# Altium project Sumobot_Schematics.PrjPcb
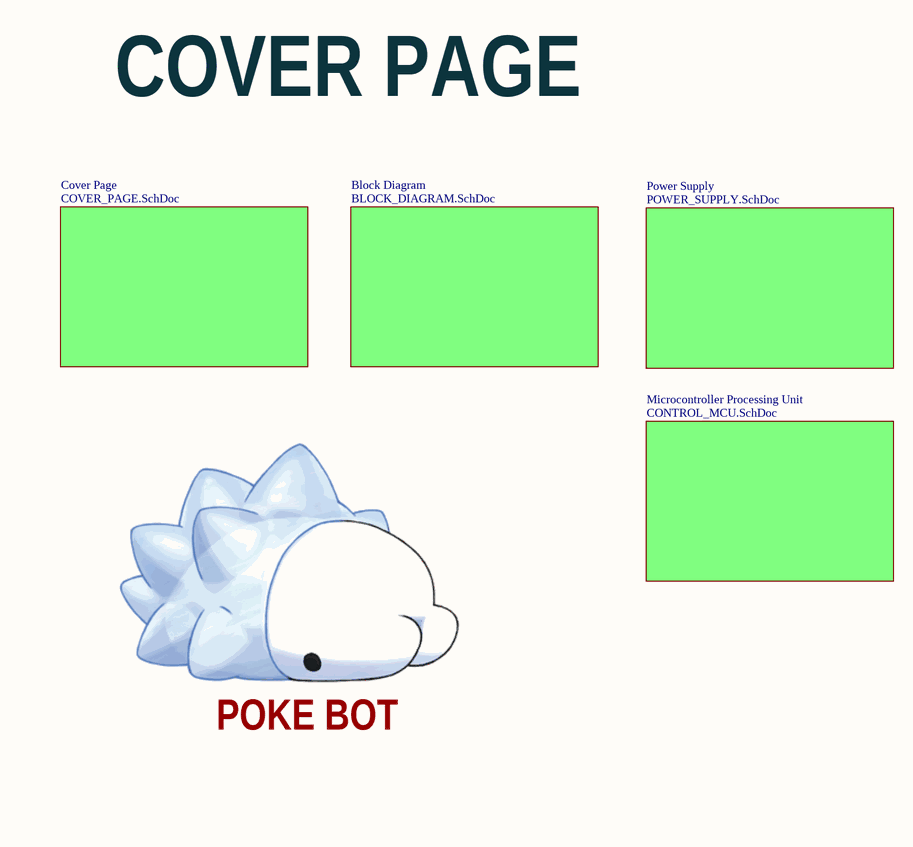
[diagram p0: DIRECTORY.SchDoc]
Author: Marcos R. López; Carnet: 231928; Curso: Fabricación de PCB [IE3028]; Revision: 1.0v
6 sheets, 27 parts. Net scope: flat (ports and power ports of the same name join across sheets).
Sheets:
  DIRECTORY.SchDoc
    Cover Page = COVER_PAGE.SchDoc
    Block Diagram = BLOCK_DIAGRAM.SchDoc
    Power Supply = POWER_SUPPLY.SchDoc
    Microcontroller Processing Unit = CONTROL_MCU.SchDoc
  PCB_ManufactureDiagram.SchDoc

## Sheet DIRECTORY.SchDoc
size A4; SheetNumber: 1; SheetTotal: 6

### Sub-sheets
Block Diagram = BLOCK_DIAGRAM.SchDoc: no entries
Cover Page = COVER_PAGE.SchDoc: no entries
Microcontroller Processing Unit = CONTROL_MCU.SchDoc: no entries
Power Supply = POWER_SUPPLY.SchDoc: no entries

### Notes on the sheet
- COVER PAGE
- POKE BOT
- Documento:
- Autor:
- Carnet:
- Proyecto:
- Curso:
- Fecha:
- Revisión:
- Tamaño:
- Carta
- Hoja:
- de:

## Sheet COVER_PAGE.SchDoc
size A4; SheetNumber: 2; SheetTotal: 6
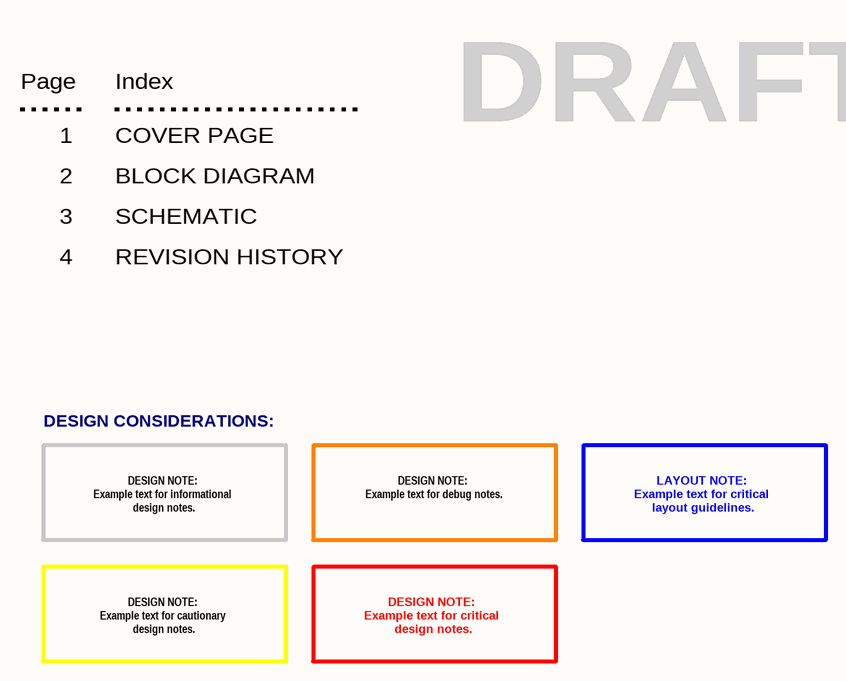
[diagram p1: COVER_PAGE.SchDoc]

### Notes on the sheet
- Page
- 1
- Index
- COVER PAGE
- DRAFT
- 2
- BLOCK DIAGRAM
- 3
- 4
- SCHEMATIC
- REVISION HISTORY
- DESIGN CONSIDERATIONS:
- DESIGN NOTE:
  Example text for debug notes.
- DESIGN NOTE:
  Example text for informational
  design notes.
- LAYOUT NOTE:
  Example text for critical
  layout guidelines.
- DESIGN NOTE:
  Example text for cautionary
  design notes.
- DESIGN NOTE:
  Example text for critical
  design notes.
- Documento:
- Autor:
- Carnet:
- Proyecto:
- Curso:
- Fecha:
- Revisión:
- Tamaño:
- Carta
- Hoja:
- de:

## Sheet BLOCK_DIAGRAM.SchDoc
size A4; SheetNumber: 2; SheetTotal: 6
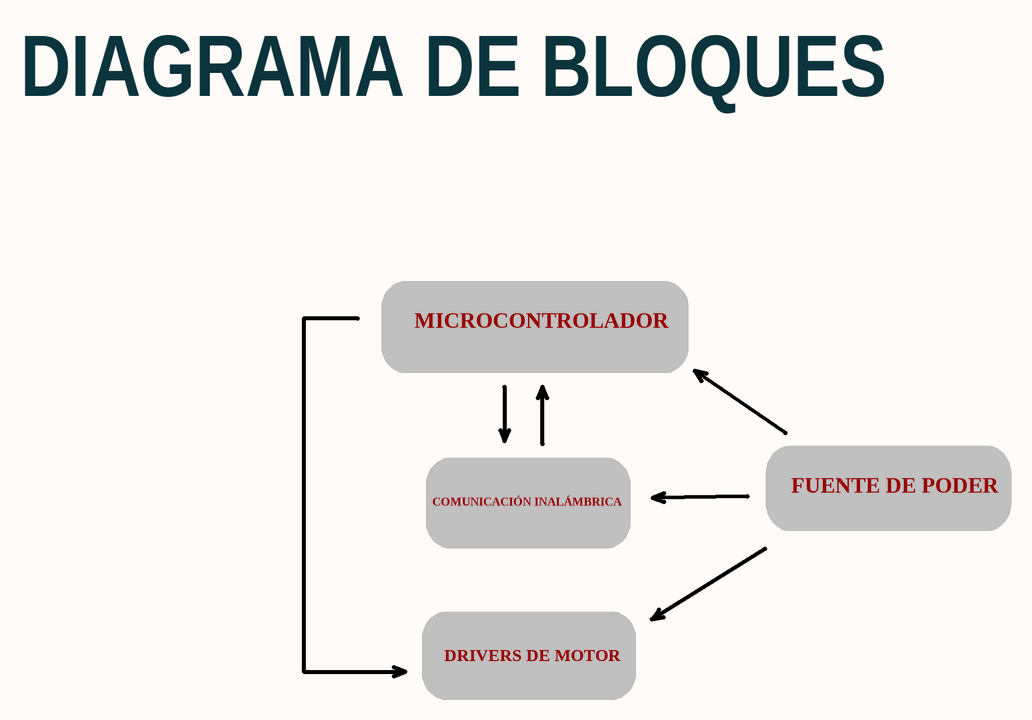
[diagram p2: BLOCK_DIAGRAM.SchDoc]

### Notes on the sheet
- DIAGRAMA DE BLOQUES
- MICROCONTROLADOR
- COMUNICACIÓN INALÁMBRICA
- FUENTE DE PODER
- DRIVERS DE MOTOR
- Documento:
- Autor:
- Carnet:
- Proyecto:
- Curso:
- Fecha:
- Revisión:
- Tamaño:
- Carta
- Hoja:
- de:

## Sheet POWER_SUPPLY.SchDoc
size A4; SheetNumber: 4; SheetTotal: 5
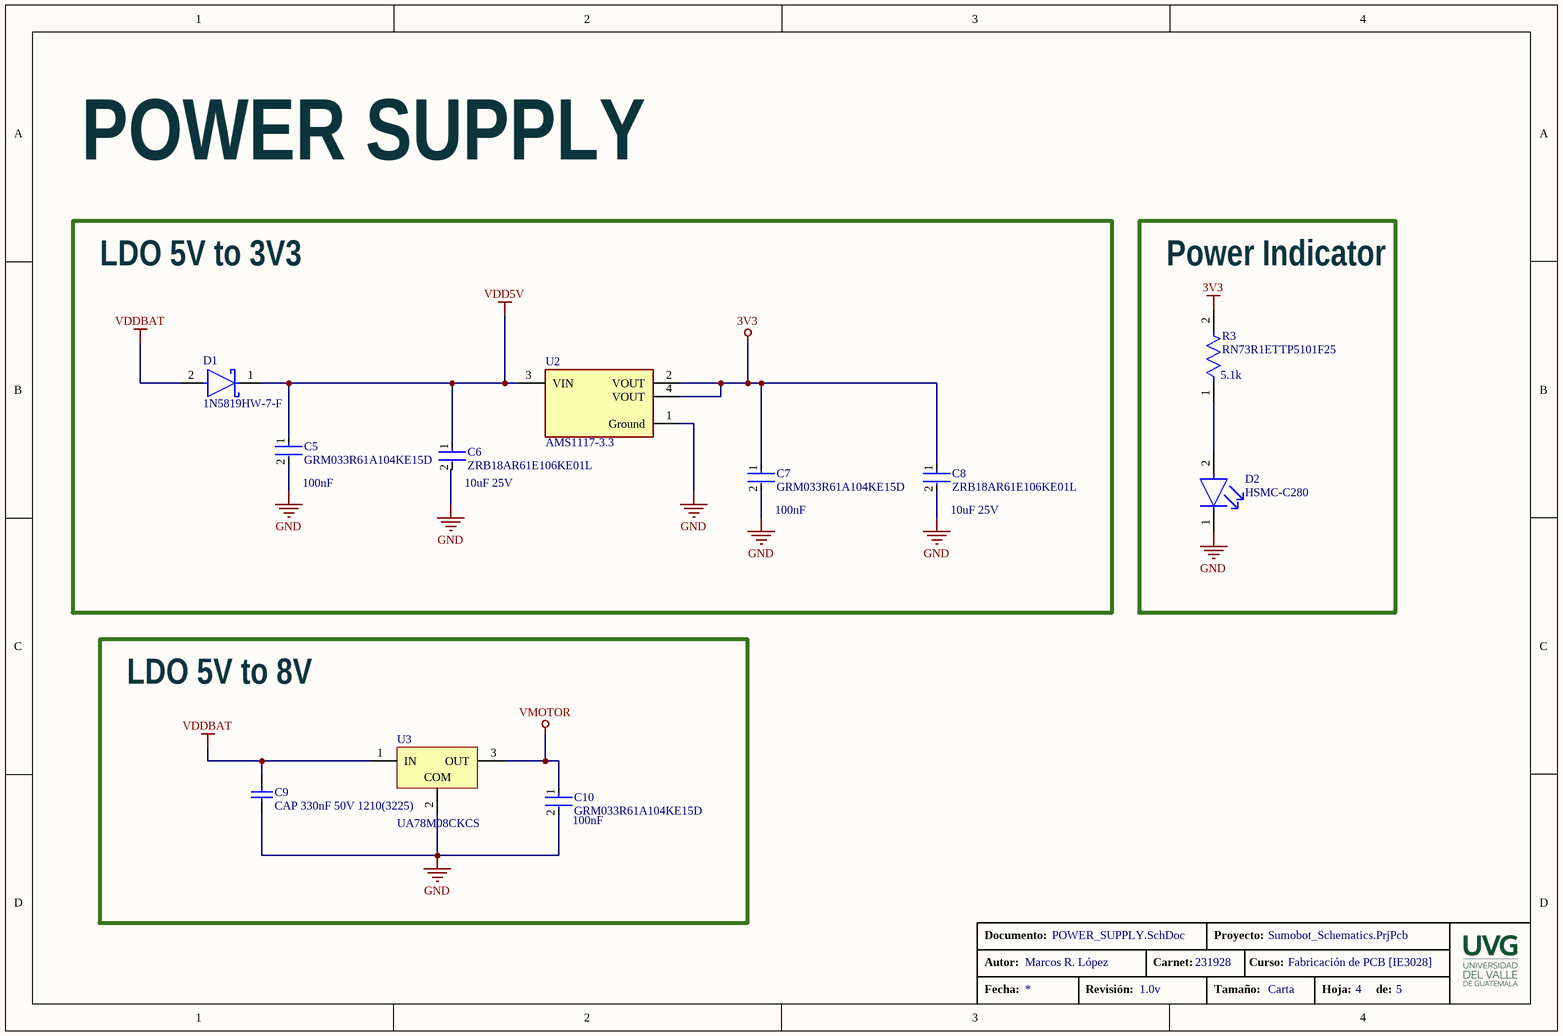
[diagram p3: POWER_SUPPLY.SchDoc]

### Parts
C5  GRM033R61A104KE15D  Capacitance: 100nF  [FP-GRM033-0_03-IPC_C]
C6  ZRB18AR61E106KE01L  value 10uF 25V  [FP-ZRB18A-0_2-MFG]
C7  GRM033R61A104KE15D  Capacitance: 100nF  [FP-GRM033-0_03-IPC_C]
C8  ZRB18AR61E106KE01L  value 10uF 25V  [FP-ZRB18A-0_2-MFG]
C9  CAP 330nF 50V 1210(3225)  [CAPC1210(3225)105_L]
C10  GRM033R61A104KE15D  Capacitance: 100nF  [FP-GRM033-0_03-IPC_C]
D1  1N5819HW-7-F  [FP-SOD123-IPC_A]
D2  HSMC-C280  [FP-HSMC-C280-MFG]
R3  RN73R1ETTP5101F25  value 5.1k  [FP-RN73R1E-IPC_C]
U2  AMS1117-3.3  [FP-AMS1117-IPC_C]
U3  UA78M08CKCS  [KCS0003A]

### Blocks framed on the sheet
LDO 5V to 3V3: C5-C8 D1 U2
Power Indicator: D2 R3
LDO 5V to 8V: C9 C10 U3

### Nets
3V3: C7.1 C8.1 R3.2 U2.2(VOUT) U2.4(VOUT)  [project net TX]
GND: C5.2 C6.2 C7.2 C8.2 C9.1 C10.2 D2.1(C) U2.1(Ground) U3.2(COM)
VDD5V: C5.1 C6.1 D1.1(C) U2.3(VIN)
VDDBAT: C9.2 D1.2(A) U3.1(IN)
VMOTOR: C10.1 U3.3(OUT)
NetD2_2: D2.2(A) R3.1

### Notes on the sheet
- POWER SUPPLY
- Documento:
- Autor:
- Carnet:
- Proyecto:
- Curso:
- Fecha:
- Revisión:
- Tamaño:
- Carta
- Hoja:
- de:

### Library data of the parts
C5 C7 C10 = CMP-2010-01264-2: Chip Multilayer Ceramic Capacitors for General Purpose, 0201, 0.10uF, X5R, 15%, 10%, 10V; Mount: Surface Mount; Dielectric: X5R; Width: 0.012inch; Tolerance: 10%; Radiation Hardening: No; Voltage Rating: 10V; REACH SVHC: No SVHC; Height: 0.3mm; Max Operating Temperature: 85°C; Voltage Rating (DC): 10V; Thickness: 0.013inch; Termination: SMD/SMT; Lead Free: Lead Free; Package Quantity: 1; Case/Package: 0201; Min Operating Temperature: -55°C; Weight: 6E-06oz; Length: 0.6mm; Case Code (Imperial): 0201; Depth: 0.3mm; Voltage: 10V; Packaging: Tape and Reel; Case Code (Metric): 0603
C6 C8 = CMP-06035-063177-1: Low Acoustic Noise Chip Multilayer Ceramic Capacitors on Interposer Board for General Purpose ZRB Series 0603 Package 1.2mm X5R @ 15% 25Vdc 10uF @ 10%
C9 = CMP-1038-01880-1: CAP 330nF 50V ±10% 1210 (3225 Metric) Thickness 1.05mm SMD; Tolerance: Â±10%; Case-Metric: 3225; Case-EIA: 1210; Technology: SMT; Rated Voltage: 50 V; Value: 330nF; Max Thickness: 1.05 mm
D1 = CMP-0303-00003-3: DIODE SCHOTTKY 40V 1A SOD123; Forward Voltage: 450mV; Capacitance: 110pF; Max Forward Surge Current (Ifsm): 25A; Peak Reverse Current: 50uA; Polarity: Standard; Element Configuration: Single; Max Power Dissipation: 450mW; Min Operating Temperature: -65°C; Package Quantity: 3000; Contact Plating: Tin; Weight: 0.000353oz; Max Repetitive Reverse Voltage (Vrrm): 40V; Max Reverse Voltage (DC): 40V; Height: 1.25mm; Average Rectified Current: 1A; Width: 1.7mm; Case/Package: SOD-123-2; Lead Free: Lead Free; Max Operating Temperature: 125°C; Current Rating: 1A; Termination: SMD/SMT; Forward Current: 1A; Radiation Hardening: No; Number of Pins: 2; Length: 2.85mm; Voltage Rating (DC): 40V; REACH SVHC: No SVHC; Peak Non-Repetitive Surge Current: 25A; Packaging: Tape and Reel; Output Current: 1A
D2 = CMP-18399-000022-1: LED RED DIFFUSED 0402 SMD; Dominant Wavelength: 626nm; Number of Elements: 1; Luminous Intensity: 90mcd; Viewing Angle: 130°; Reverse Voltage: 5V; Forward Current: 20mA; Lens Color: White; Power Rating: 60mW; Forward Voltage: 1.9V; Luminous Flux: 155lm; Contact Plating: Gold; Number of Pins: 2; REACH SVHC: No SVHC; Lens Style: Diffused; Color: Red; Packaging: Tape and Reel; Max Operating Temperature: 85°C; Radiation Hardening: No; Length: 1mm; Number of LEDs: 1; Case/Package: 0402; Min Operating Temperature: -40°C; Case Code (Metric): 1005; Case Code (Imperial): 0402; Test Current: 20mA; Lead Free: Lead Free; Height: 0.4mm; Illumination Color: Red; Max Power Dissipation: 60mW; Package Quantity: 4000; Mount: Surface Mount; Wavelength: 626nm; Depth: 0.5mm; Lens Transparency: Diffused; Power Dissipation: 60mW; Width: 0.5mm
R3 = CMP-04015-008529-1: 5.1kΩ ±1% 0.063W, 1/16W Chip Resistor 0402 (1005 Metric) Moisture Resistant Thin Film
U2 = CMP-209535-000001-1: LDO Voltage Regulators 1A, 3.3V; Manufacturer: Advanced Monolithic Systems; Dropout Voltage: 1.1V; Output Type: Fixed; Nominal Supply Current: 5mA; Max Power Dissipation: 1.2W; Max Supply Voltage: 15V; Number Of Outputs: 1; Standoff Height: 0.64mm; Max Junction Temp: +125°C; Height: 1.8mm; Package: AMS1117; Device Class L2: Power Management ICs; ComponentLink2Description: Datasheet; ComponentLink2URL: http://www.advanced-monolithic.com/pdf/ds1117.pdf; Category: IC; RoHS: TRUE; Automotive: No; Device Class L1: Integrated Circuits (ICs); Output Current: 1A; Device Class L3: Voltage Regulators - Linear; Temperature: -40°C to +125°C; Output Voltage: 3.3V; Manufacturer Part Number: AMS1117-3.3; Temperature Range Low: -40°C; Octopart: https://octopart.com/ams1117-3.3-advanced+monolithic+systems-25899300; Lead Free: Yes; Ipc Land Pattern Name: SOT229P700X180-4; Temperature Range High: +125°C
U3 = CMP-0324-00074-2: Fixed Regulator with 10.5 to 25 V Input and 8 V Output, 0 to 125 degC, 3-Pin TO-220 (KCS), Pb-Free (RoHS); Manufacturer: Texas Instruments; Vin(Max)(V): 25; Vout(Min)(V): 8; Iout(Max)(A): 0.5; Vin(Min)(V): 10.5; Iq(Typ)(mA): 6; SubFamily: Standard Voltage Regulator; PackageReference: KCS0003A; ComponentLink2Description: URL Link1; ComponentLink1Description: Datasheet; Eco-Plan: Pb-Free (RoHS); PackageDescription: Plastic Cylindrical Package, Formed Lead Option (TO-92); PackageVersion: revC, Oct-2001; Mounting Technology: Through Hole; Code_JEDEC: TO-226-AA; DatasheetVersion: SLVS059Q; ComponentLink2URL: Samples URL:http://www.ti.com/product/ua78m08#samples; Vout(Max)(V): 8; PartNumber: UA78M08CKCS; ComponentLink1URL: http://www.ti.com/general/docs/lit/getliterature.tsp?genericPartNumber=UA78M08&fileType=pdf

## Sheet CONTROL_MCU.SchDoc
size A4; SheetNumber: 4; SheetTotal: 5
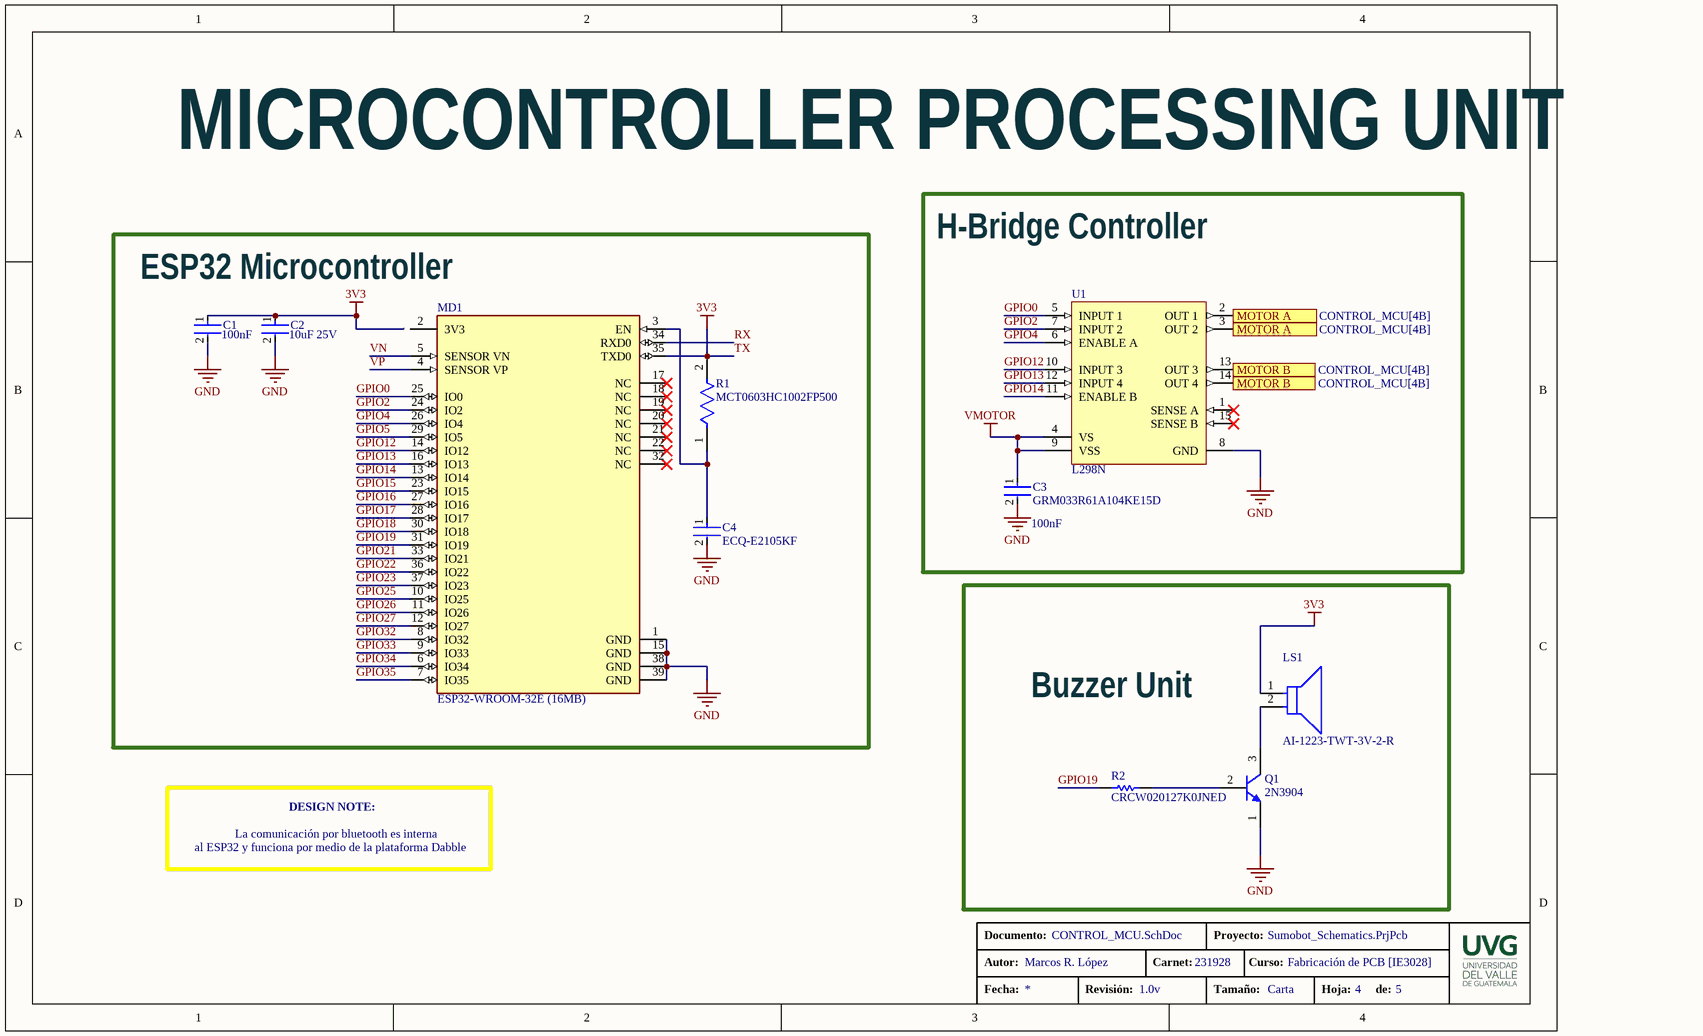
[diagram p4: CONTROL_MCU.SchDoc]

### Parts
C1  Capacitance: 100nF  [FP-GRM033-0_03-IPC_C]  (hidden comment: M033R61A104KE15D)
C2  value 10uF 25V  [FP-ZRB18A-0_2-MFG]  (hidden comment: ZRB18AR61E106KE01L)
C3  GRM033R61A104KE15D  Capacitance: 100nF  [FP-GRM033-0_03-IPC_C]
C4  ECQ-E2105KF  [FP-ECQ-E2105KF-MFG]
LS1  AI-1223-TWT-3V-2-R  [FP-AI-1223-TWT-3V-2-R-MFG]
MD1  ESP32-WROOM-32E (16MB)  [FP-ESP32-WROOM-32E_16MB-MFG]
Q1  2N3904  [ONSC-TO-92-3-29-11]
R1  MCT0603HC1002FP500  [FP-MCT0603-IPC_B]
R2  CRCW020127K0JNED  [RESC0603X28X15ML05T05]
U1  L298N  [STM-FM-15]

### Blocks framed on the sheet
H-Bridge Controller: C3 U1
ESP32 Microcontroller: C1 C2 C4 MD1 R1
Buzzer Unit: LS1 Q1 R2

### Ports
MOTOR A (see CONTROL_MCU[4B]), MOTOR B (see CONTROL_MCU[4B])

### Nets
GND: C1.2 C2.2 C3.2 C4.2 MD1.1(GND) MD1.15(GND) MD1.38(GND) MD1.39(GND) Q1.1(E) U1.8(GND)
TX: C1.1 C2.1 LS1.1(C) MD1.35(TXD0) R1.2  [also labelled 3V3]
VMOTOR: C3.1 U1.4(VS) U1.9(VSS)
GPIO0: MD1.25(IO0) U1.5(INPUT_1)
GPIO2: MD1.24(IO2) U1.7(INPUT_2)
GPIO4: MD1.26(IO4) U1.6(ENABLE_A)
GPIO5: MD1.29(IO5)
GPIO12: MD1.14(IO12) U1.10(INPUT_3)
GPIO13: MD1.16(IO13) U1.12(INPUT_4)
GPIO14: MD1.13(IO14) U1.11(ENABLE_B)
GPIO15: MD1.23(IO15)
GPIO16: MD1.27(IO16)
GPIO17: MD1.28(IO17)
GPIO18: MD1.30(IO18)
GPIO19: MD1.31(IO19) R2.2
GPIO21: MD1.33(IO21)
GPIO22: MD1.36(IO22)
GPIO23: MD1.37(IO23)
GPIO25: MD1.10(IO25)
GPIO26: MD1.11(IO26)
GPIO27: MD1.12(IO27)
GPIO32: MD1.8(IO32)
GPIO33: MD1.9(IO33)
GPIO34: MD1.6(IO34)
GPIO35: MD1.7(IO35)
RX: MD1.34(RXD0)
VN: MD1.5(SENSOR_VN)
VP: MD1.4(SENSOR_VP)
NetC4_1: C4.1 MD1.3(EN) R1.1
NetLS1_2: LS1.2(A) Q1.3(C)
NetQ1_2: Q1.2(B) R2.1
NetU1_2: U1.2(OUT_1) U1.3(OUT_2) ; port MOTOR A
NetU1_13: U1.13(OUT_3) U1.14(OUT_4) ; port MOTOR B

Not connected (* = marked no-connect by the designer): MD1 2(3V3) 17(NC)* 18(NC)* 19(NC)* 20(NC)* 21(NC)* 22(NC)* 32(NC)*; U1 1(SENSE_A)* 15(SENSE_B)*

### Notes on the sheet
- MICROCONTROLLER PROCESSING UNIT
- al ESP32 y funciona por medio de la plataforma Dabble
- La comunicación por bluetooth es interna
- DESIGN NOTE:
- Documento:
- Autor:
- Carnet:
- Proyecto:
- Curso:
- Fecha:
- Revisión:
- Tamaño:
- Carta
- Hoja:
- de:

### Library data of the parts
C1 C3 = CMP-2010-01264-2: as C5 on sheet POWER_SUPPLY; Mount: Surface Mount; Dielectric: X5R; Width: 0.012inch; Tolerance: 10%; Radiation Hardening: No; Voltage Rating: 10V; REACH SVHC: No SVHC; Height: 0.3mm; Max Operating Temperature: 85°C; Voltage Rating (DC): 10V; Thickness: 0.013inch; Termination: SMD/SMT; Lead Free: Lead Free; Package Quantity: 1; Case/Package: 0201; Min Operating Temperature: -55°C; Weight: 6E-06oz; Length: 0.6mm; Case Code (Imperial): 0201; Depth: 0.3mm; Voltage: 10V; Packaging: Tape and Reel; Case Code (Metric): 0603
C2 = CMP-06035-063177-1: as C6 on sheet POWER_SUPPLY
C4 = CMP-00287-00215881-1: ECQ-E2105KF Cap Film 1uF 250V PET 10% (18.5 X 7.4 X 15mm) Radial 15mm 105 C Bulk; NexarPartId: 215881; Lead Length: 20mm; Lead Diameter: 800µm; Lead/Base Style: Straight; Capacitance: 1µF; Dielectric Material: Polyester; Voltage Rating (AC): 250V; Tolerance: 10%; REACH SVHC: Unknown; Contact Plating: Tin; Height - Seated (Max): 16.002mm; Length: 18.5mm; Lead Free: Lead Free; Voltage Rating: 250V; Dielectric: PET; Height: 15mm; Radiation Hardening: No; Mount: Through Hole; Packaging: Bulk; Min Operating Temperature: -40°C; Width: 7.3914mm; Depth: 7.4mm; Case/Package: Radial; Voltage Rating (DC): 250V; Schedule B: 8532250070, 8532250070; RoHS: Compliant; Termination: Radial; Lead Pitch: 15mm; Max Operating Temperature: 105°C
LS1 = CMP-103888-000003-1: BUZZER MAGNETIC 3V 12MM TH; Min Supply Voltage (DC): 2V; Operating Supply Current: 30mA; Max Supply Voltage (DC): 4V; Input Type: DC; Frequency: 2.3kHz; Series: AI; Nominal Supply Voltage (DC): 3V; Packaging: Tray; Max Operating Temperature: 70°C; Height: 7.5mm; Termination: PC Pins; Max Supply Current: 30mA; Mount: Through Hole; Diameter: 12mm; Voltage Rating: 3V; Sensing Method: Magnetic; Min Operating Temperature: -20°C; Contact Plating: Tin
MD1 = CMP-194065-000027-1: RX TXRX MOD WIFI TRACE ANT SMD
Q1 = CMP-2000-05562-1: General Purpose Transistor, NPN Silicon, 200 mA, 60 V, -55 to 150 degC, 3-Pin TO-92, RoHS, Bulk; Manufacturer: ONSemiconductor; Emitter- Base Voltage VEBO: 6V; Maximum Power Dissipation: 625mW; Maximum DC Collector Current: 0.2A; Collector- Emitter Voltage VCEO Max: 40V; Collector- Base Voltage VCBO: 60V; DC Collector/Base Gain hfe Min: 60; Configuration: Single; Collector-Emitter Saturation Voltage: 0.3V; Gain Bandwidth Product fT: 270MHz; Mounting Style: ThroughHole; Package / Case: TO-92-3(TO-226); Mounting Technology: ThroughHole; Minimum Operating Temperature: -65C; Datasheet Version: Rev. 8, 08/2012; Product Category: BipolarTransistors-BJT; Factory Pack Quantity: 5000; Transistor Polarity: NPN; Package Description: 3-Pin Transistor Outline, Body 4.825 x 3.685 mm, Pitch 1.27 mm; RoHS: Details; Datasheet URL: https://datasheet.ciiva.com/4725/2n3903-d-285841-4725808.pdf; Packaging: Bulk; Maximum Operating Temperature: +150C; Package Reference: TO-92-3-29-11; Brand: ONSemiconductor; Manufacturer URL: http://www.onsemi.com/
R1 = CMP-02407-001090-1: RES SMD 100 OHM 1% 1/8W 0603
R2 = CMP-2004-00383-1: Manufacturer: Vishay Dale; Part Number: CRCW020127K0JNED
U1 = CMP-2000-06526-1: Dual Full-Bridge Driver, 4.8 to 46 V, -40 to 150 degC, 15-Pin FM (MW 15L), RoHS, Tube; Manufacturer: STMicroelectronics; PartNumber: L298; Output Current: 2A; Supply Voltage Max: 7V; Driver Case Style: Multiwatt; Supply Voltage Min: 4.5V; No. of Pins: 15Pins; SVHC: NoSVHC(17-Dec-2015); Output Voltage: 46V; No. of Outputs: 4Outputs; Motor Type: FullBridge; MSL: -; Package Description: 15-Pin Flange Mount, Body 5 x 19.6 mm, Pitch 1.27 mm; Datasheet Version: 01/2000; Package Reference: FM-15; Mounting Technology: ThroughHole; Packaging: Each; Automotive Qualification Standard: -; Product Range: -; Datasheet URL: https://datasheet.ciiva.com/15109/getdatasheetpartid-50682-15109332.pdf; Operating Temperature Max: 130°C; Operating Temperature Min: -25°C; Manufacturer URL: http://www.st.com/

## Sheet PCB_ManufactureDiagram.SchDoc
size A4; SheetNumber: 6; SheetTotal: 6
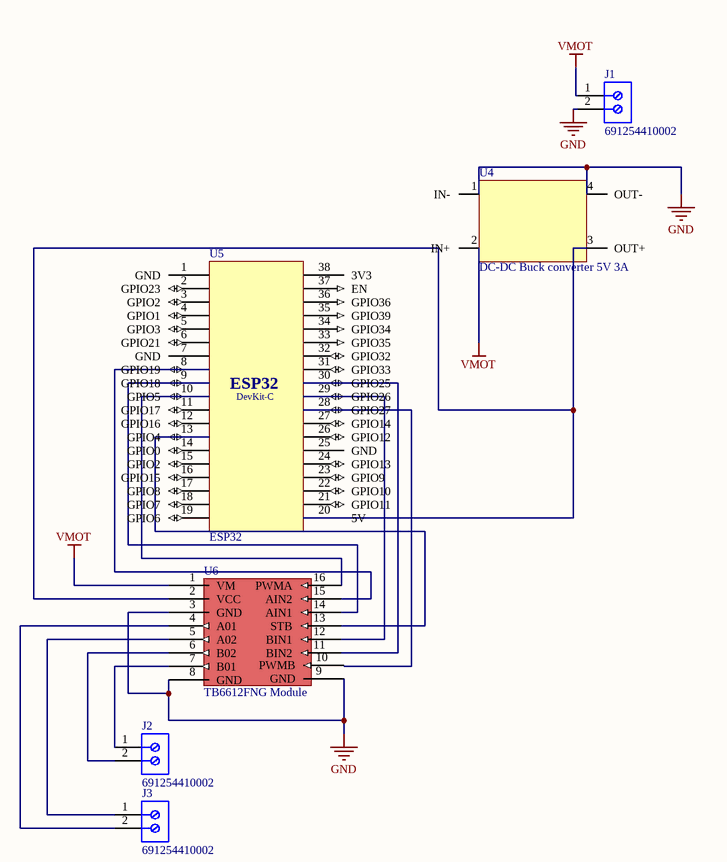
[diagram p5: PCB_ManufactureDiagram.SchDoc]

### Parts
J1  691254410002  [691254410002]
J2  691254410002  [691254410002]
J3  691254410002  [691254410002]
U4  DC-DC Buck converter 5V 3A  [DC-DC Buck converter 5V 3A]
U5  ESP32  [ESP32_DevKitCWROOM32]
U6  TB6612FNG Module  [TB6612FNG]

### Nets
GND: J1.2 U4.1(IN-) U4.4(OUT-) U6.3(GND) U6.8(GND) U6.9(GND)
VMOT: J1.1 U4.2(IN+) U6.1(VM)
NetJ2_1: J2.1 U6.7(B01)
NetJ2_2: J2.2 U6.6(B02)
NetJ3_1: J3.1 U6.5(A02)
NetJ3_2: J3.2 U6.4(A01)
NetU4_3: U4.3(OUT+) U5.20(5V) U6.2(VCC)
NetU5_8: U5.8(GPIO19) U6.15(AIN2)
NetU5_9: U5.9(GPIO18) U6.14(AIN1)
NetU5_10: U5.10(GPIO5) U6.16(PWMA)
NetU5_13: U5.13(GPIO4) U6.13(STB)
NetU5_29: U5.29(GPIO26) U6.12(BIN1)
NetU5_30: U5.30(GPIO25) U6.11(BIN2)

Not connected (* = marked no-connect by the designer): U5 1(GND) 2(GPIO23) 3(GPIO2) 4(GPIO1) 5(GPIO3) 6(GPIO21) 7(GND) 11(GPIO17) 12(GPIO16) 14(GPIO0) 15(GPIO2) 16(GPIO15) 17(GPIO8) 18(GPIO7) 19(GPIO6) 21(GPIO11) 22(GPIO10) 23(GPIO9) 24(GPIO13) 25(GND) 26(GPIO12) 27(GPIO14) 28(GPIO27) 31(GPIO33) 32(GPIO32) 33(GPIO35) 34(GPIO34) 35(GPIO39) 36(GPIO36) 37(EN) 38(3V3); U6 10(PWMB)

### Notes on the sheet
- Documento:
- Autor:
- Carnet:
- Proyecto:
- Curso:
- Fecha:
- Revisión:
- Tamaño:
- Carta
- Hoja:
- de:
- (in symbol ESP32-WROOM32) DevKit-C

### Library data of the parts
J1-J3 = CMP-1502-02748-3: Terminal Block, 7.62MM Pitch, Horizontal, Dual Pin, 12-30 AWG, 2 Pin
U4 = DC-DC Buck converter 5V 3A: MP1584 Series 28 V 3 A 1.5 MHz SMT Step-Down Converter - SOIC-8E; Manufacturer: Monolithic Power Systems; Manufacturer Part Number: MP1584EN-LF-Z; Manufacturer Lifecycle Status: NRFND; Max Supply Voltage: 28V; Max Junction Temperature (Tj): 125°C; Max Output Voltage: 25V; Max Power Dissipation: 2.5W; Max Switching Frequency: 1.5MHz; Min Input Voltage: 4.5V; Min Output Voltage: 800mV; Nominal Supply Voltage: 12V; Nominal Supply Current: 100µA; Number of Channels: 1; Output Configuration: Positive; Output Type: Adjustable; Synchronous Rectifier: No; Supplier: DigiKey; Supplier Part Number: 1589-1533-1-ND; RoHS: Compliant; Category: Voltage Regulators - Switching; Stock: 3098; Pricing: 1=2.75, 10=2.051, 25=1.876, 100=1.6842, 250=1.59268, 500=1.53748, 1000=1.49207 (USD); Ambient Temperature Range High: 85°C; Case/Package: SOIC; Contact Plating: Tin; Height: 1.7mm; Height - Seated (Max): 1.7mm; Lead Free: Lead Free; Length: 4.9mm; Lifecycle Status: NRND; Max Operating Temperature: 85°C; Max Output current: 3A; Min Operating Temperature: -20°C; Min Supply Voltage: 4.5V; Mounting Technology: Surface Mount; Number of Circuits: 1; Number of Outputs: 1; Pins: 8; Number of Terminals: 8; Operating Supply Voltage: 28V; Output Current: 3A; Output Voltage: 25V; REACH SVHC: Yes; Switching Frequency: 1.5MHz; Terminal Pitch: 1.27mm; Topology: Buck; Width: 3.9mm; ComponentLink1URL: https://datasheet.octopart.com:443/MP1584EN-LF-Z-Monolithic-Power-Systems-datasheet-155981995.pdf?src-supplier=Monolithic+Power+Systems; ComponentLink1Description: https://datasheet.octopart.com:443/MP1584EN-LF-Z-Monolithic-Power-Systems-datasheet-155981995.pdf?src-supplier=Monolithic+Power+Systems; ComponentLink2URL: https://datasheet.octopart.com:443/MP1584EN-LF-Z-Monolithic-Power-Systems-datasheet-180786201.pdf?src-supplier=IHS; ComponentLink2Description: https://datasheet.octopart.com:443/MP1584EN-LF-Z-Monolithic-Power-Systems-datasheet-180786201.pdf?src-supplier=IHS; ComponentLink3URL: https://datasheet.octopart.com:443/MP1584EN-LF-Z-Monolithic-Power-Systems-datasheet-138896877.pdf?src-supplier=Upverter; ComponentLink3Description: https://datasheet.octopart.com:443/MP1584EN-LF-Z-Monolithic-Power-Systems-datasheet-138896877.pdf?src-supplier=Upverter; ComponentLink4URL: https://datasheet.octopart.com:443/MP1584EN-LF-Z-Monolithic-Power-Systems-datasheet-28355791.pdf?src-supplier=Augswan; ComponentLink4Description: https://datasheet.octopart.com:443/MP1584EN-LF-Z-Monolithic-Power-Systems-datasheet-28355791.pdf?src-supplier=Augswan; ComponentLink5URL: https://datasheet.octopart.com:443/MP1584EN-LF-Z-Monolithic-Power-Systems-datasheet-157246321.pdf?src-supplier=LKR; ComponentLink5Description: https://datasheet.octopart.com:443/MP1584EN-LF-Z-Monolithic-Power-Systems-datasheet-157246321.pdf?src-supplier=LKR; ComponentLink6URL: https://datasheet.octopart.com:443/MP1584EN-LF-Z-Monolithic-Power-Systems-datasheet-130112029.pdf?src-supplier=TME; ComponentLink6Description: https://datasheet.octopart.com:443/MP1584EN-LF-Z-Monolithic-Power-Systems-datasheet-130112029.pdf?src-supplier=TME; ComponentLink7URL: https://datasheet.octopart.com:443/MP1584EN-LF-Z-Monolithic-Power-Systems-datasheet-26504489.pdf?src-supplier=Future+Electronics; ComponentLink7Description: https://datasheet.octopart.com:443/MP1584EN-LF-Z-Monolithic-Power-Systems-datasheet-26504489.pdf?src-supplier=Future+Electronics
U5 = ESP32-WROOM32: Multiprotocol Modules SMD Module ESP32-WROOM-32E, ESP32-D0WD-V3, 16 MB SPI flash, PCB antenna; Manufacturer: Espressif Systems; Manufacturer Part Number: ESP32-WROOM-32E-N16; Max Supply Voltage: 3.6V; Min Supply Voltage: 3V; Operating Supply Voltage: 3.3V; Supplier: DigiKey; Supplier Part Number: 5407-ESP32-WROOM-32E-N16CT-ND; RoHS: Compliant; Category: RF Transceiver Modules and Modems; Stock: 9659; Pricing: 1=5.71, 10=4.941, 25=4.6748, 100=4.3087, 250=4.0894 (USD); Height - Seated (Max): 3.25mm; Harmonized Tariff Schedule (HTS) Code: 8542.31.00.30; Length: 25.5mm; Max Operating Temperature: 85°C; Min Operating Temperature: -40°C; Number of Terminals: 38; REACH SVHC: Yes; Terminal Pitch: 1.27mm; Width: 18mm; ComponentLink1URL: https://datasheet.octopart.com:443/ESP32-WROOM-32E-N16-Espressif-Systems-datasheet-182247776.pdf?src-supplier=IHS; ComponentLink1Description: https://datasheet.octopart.com:443/ESP32-WROOM-32E-N16-Espressif-Systems-datasheet-182247776.pdf?src-supplier=IHS; ComponentLink2URL: https://datasheet.octopart.com:443/ESP32-WROOM-32E-N16-Espressif-Systems-datasheet-192340067.pdf?src-supplier=HQonline; ComponentLink2Description: https://datasheet.octopart.com:443/ESP32-WROOM-32E-N16-Espressif-Systems-datasheet-192340067.pdf?src-supplier=HQonline; ComponentLink3URL: https://datasheet.octopart.com:443/ESP32-WROOM-32E-N16-Espressif-Systems-datasheet-188867343.pdf?src-supplier=TME; ComponentLink3Description: https://datasheet.octopart.com:443/ESP32-WROOM-32E-N16-Espressif-Systems-datasheet-188867343.pdf?src-supplier=TME; ComponentLink4URL: https://datasheet.octopart.com:443/ESP32-WROOM-32E-N16-Espressif-Systems-datasheet-165560559.pdf?src-supplier=TME; ComponentLink4Description: https://datasheet.octopart.com:443/ESP32-WROOM-32E-N16-Espressif-Systems-datasheet-165560559.pdf?src-supplier=TME; ComponentLink5URL: https://datasheet.octopart.com:443/ESP32-WROOM-32E-N16-Espressif-Systems-datasheet-151884363.pdf?src-supplier=Future+Electronics; ComponentLink5Description: https://datasheet.octopart.com:443/ESP32-WROOM-32E-N16-Espressif-Systems-datasheet-151884363.pdf?src-supplier=Future+Electronics
U6 = TB6612FNG: TB6612FNG Motion Motor Control Add-On Board; Manufacturer: SparkFun; Manufacturer Part Number: ROB-14451; Supplier: Mouser; Supplier Part Number: ROB-14451; Category: Uncategorized; Pricing: 1=5.5 (USD); RoHS: Non-Compliant

## Nets that join several sheets
GND: POWER_SUPPLY (9 pins), CONTROL_MCU (10 pins), PCB_ManufactureDiagram (6 pins)
TX: POWER_SUPPLY (5 pins), CONTROL_MCU (5 pins)
VMOTOR: POWER_SUPPLY (C10.1 U3.3), CONTROL_MCU (C3.1 U1.4 U1.9)